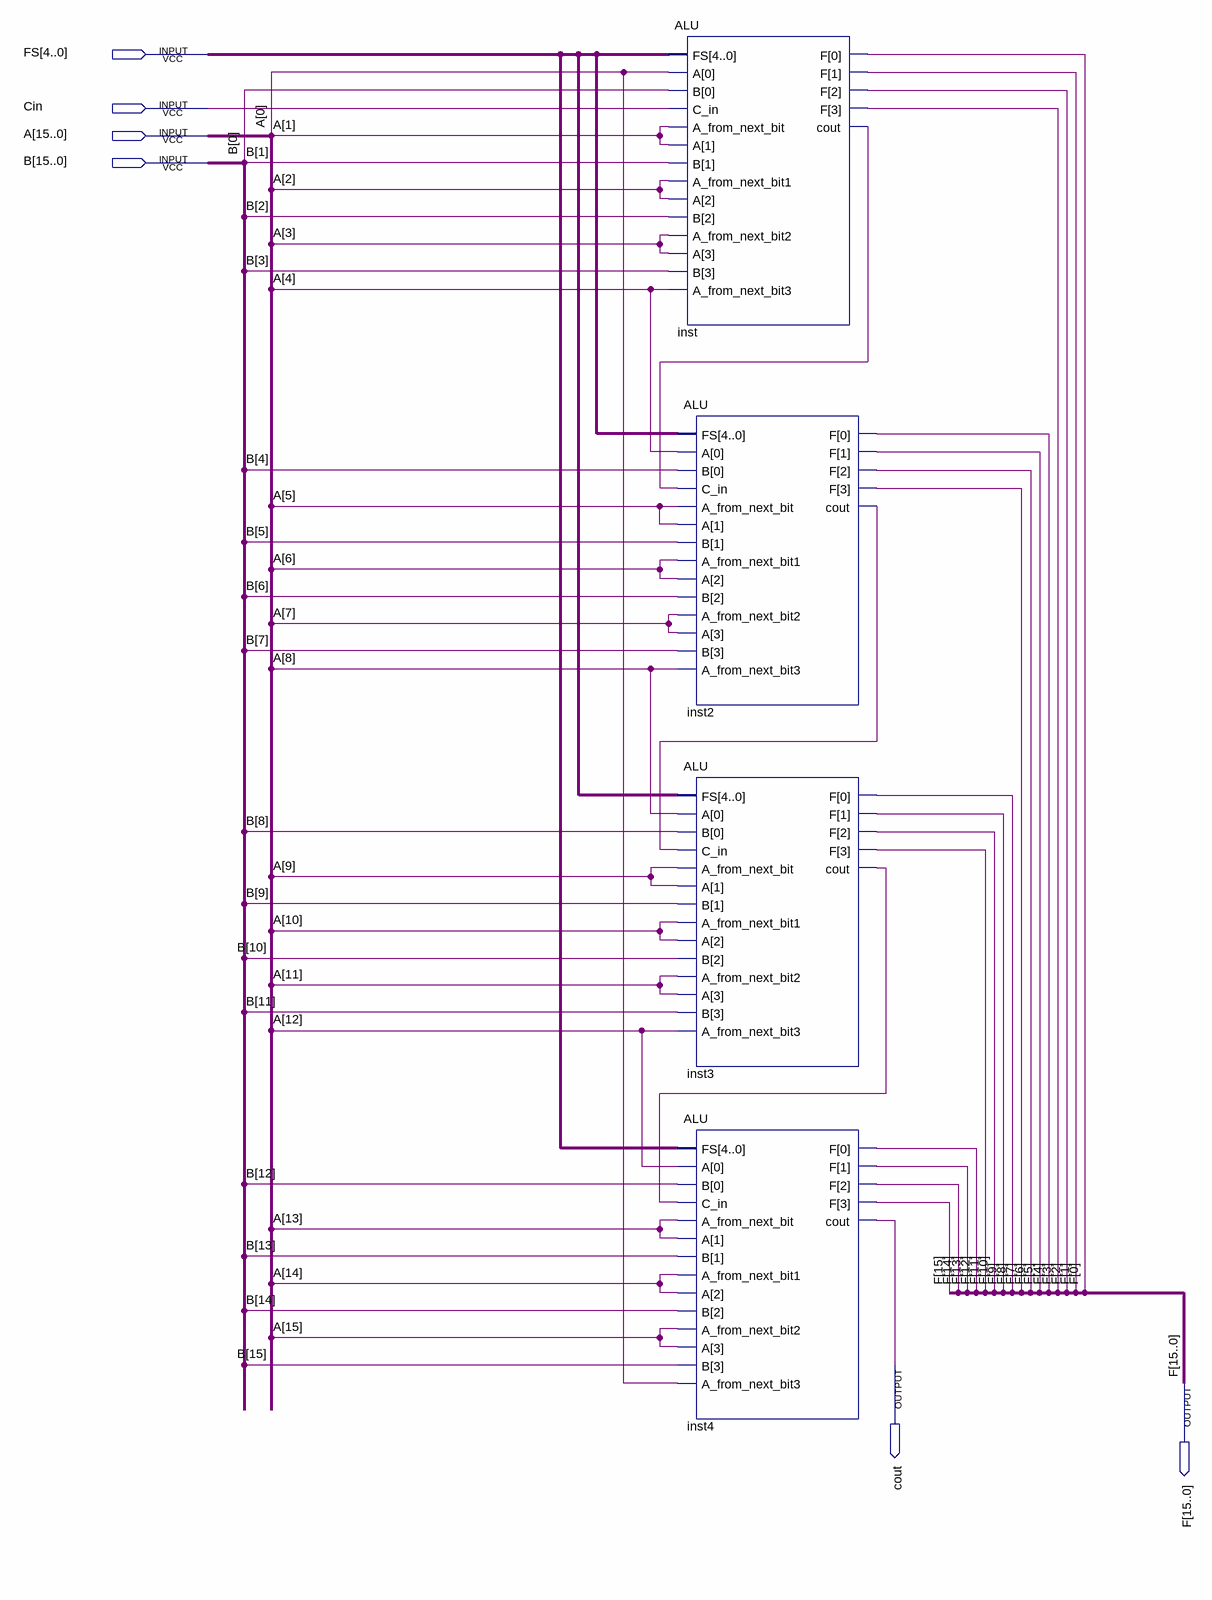
[diagram p0: schematic sheet]
// Quartus schematic ALU16bit.bdf as structural Verilog: 4 symbols, 6 pins
module ALU16bit (
  input  [4:0] FS,
  input  Cin,
  input  [15:0] A,
  input  [15:0] B,
  output cout,
  output [15:0] F
);

  wire inst2_cout, inst3_cout, inst_cout;

  ALU inst (
    .FS(FS), .A(A[3:0]), .B(B[3:0]), .C_in(Cin), .A_from_next_bit(A[1]), .A_from_next_bit1(A[2]),
    .A_from_next_bit2(A[3]), .A_from_next_bit3(A[4]), .F(F[3:0]), .cout(inst_cout));
  ALU inst2 (
    .FS(FS), .A(A[7:4]), .B(B[7:4]), .C_in(inst_cout), .A_from_next_bit(A[5]), .A_from_next_bit1(A[6]),
    .A_from_next_bit2(A[7]), .A_from_next_bit3(A[8]), .F(F[7:4]), .cout(inst2_cout));
  ALU inst3 (
    .FS(FS), .A(A[11:8]), .B(B[11:8]), .C_in(inst2_cout), .A_from_next_bit(A[9]), .A_from_next_bit1(A[10]),
    .A_from_next_bit2(A[11]), .A_from_next_bit3(A[12]), .F(F[11:8]), .cout(inst3_cout));
  ALU inst4 (
    .FS(FS), .A(A[15:12]), .B(B[15:12]), .C_in(inst3_cout), .A_from_next_bit(A[13]),
    .A_from_next_bit1(A[14]), .A_from_next_bit2(A[15]), .A_from_next_bit3(A[0]), .F(F[15:12]), .cout(cout));
endmodule
